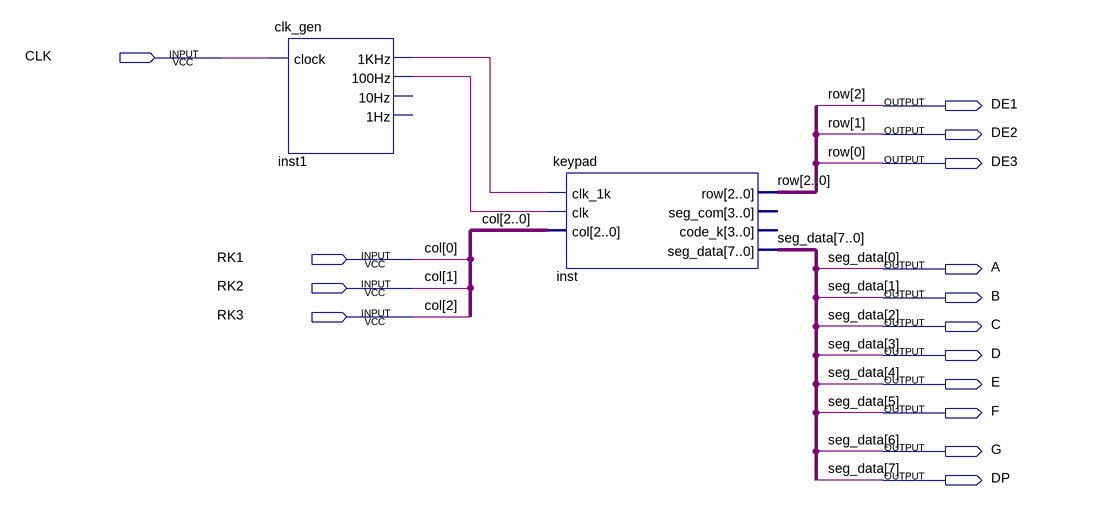
[diagram p0: schematic sheet]
// Quartus schematic keypad_test.bdf as structural Verilog: 2 symbols, 15 pins
module keypad_test (
  input  CLK,
  input  RK1,
  input  RK2,
  input  RK3,
  output DE1,
  output DE2,
  output DE3,
  output A,
  output B,
  output C,
  output D,
  output E,
  output F,
  output G,
  output DP
);

  wire inst1_1khz, inst1_100hz;

  clk_gen inst1 (.clock(CLK), .\1KHz (inst1_1khz), .\100Hz (inst1_100hz));  // open: 10Hz, 1Hz
  keypad inst (
    .clk_1k(inst1_1khz), .clk(inst1_100hz), .col({RK3, RK2, RK1}), .row({DE1, DE2, DE3}),
    .seg_data({DP, G, F, E, D, C, B, A}));  // open: seg_com, code_k

  // Other names for the same wires on the sheet: col[2:0] = {RK3, RK2, RK1}; row[2:0] = {DE1, DE2, DE3};
  //   seg_data[7:0] = {DP, G, F, E, D, C, B, A}
endmodule
